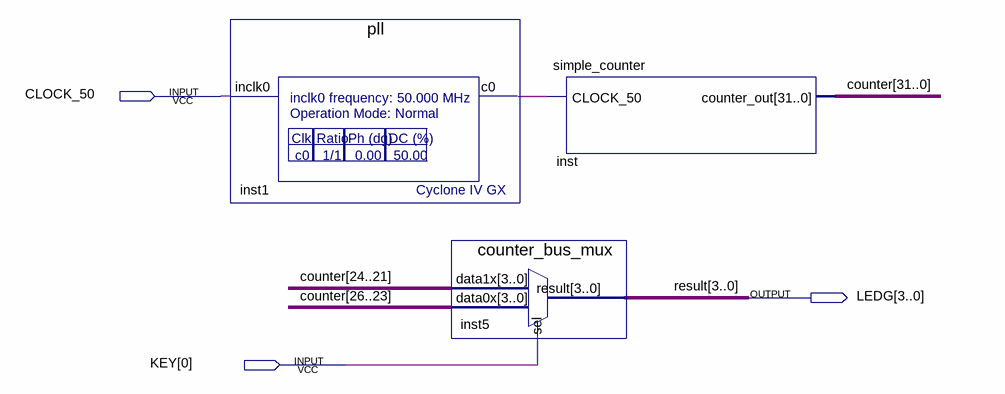
[diagram p0: schematic sheet]
// Quartus schematic my_first_fpga.bdf as structural Verilog: 3 symbols, 3 pins
module my_first_fpga (
  input  CLOCK_50,
  input  [0:0] KEY,
  output [3:0] LEDG
);

  wire inst1_c0;
  wire [31:0] counter;

  pll inst1 (.inclk0(CLOCK_50), .c0(inst1_c0));
  counter_bus_mux inst5 (.data1x(counter[24:21]), .data0x(counter[26:23]), .sel(KEY[0]), .result(LEDG));
  simple_counter inst (.CLOCK_50(inst1_c0), .counter_out(counter));

  // Other names for the same wires on the sheet: result[3:0] = LEDG
endmodule
